# Altium project RFMC.PrjPcb (part 2 of 2)

## Sheet RFMC_DAC.SchDoc: RFMC
size 420 x 297 mm; Author: T. Przywozki; CompanyName: WUT ISE; DrawnBy: T. Przywozki; Organization: WUT ISE; Address1: Warsaw University of Technology; Address2: Nowowiejska 15/19 00-665 Warsaw; Address3: Tomasz.Przywozki@pw.edu.pl; Revision: 1.0; SheetNumber: 3; SheetTotal: 4; ModifiedBy: -; CheckedDate: -; DivGrp: ISE; Designer: T. Przywozki; Project: RFMC
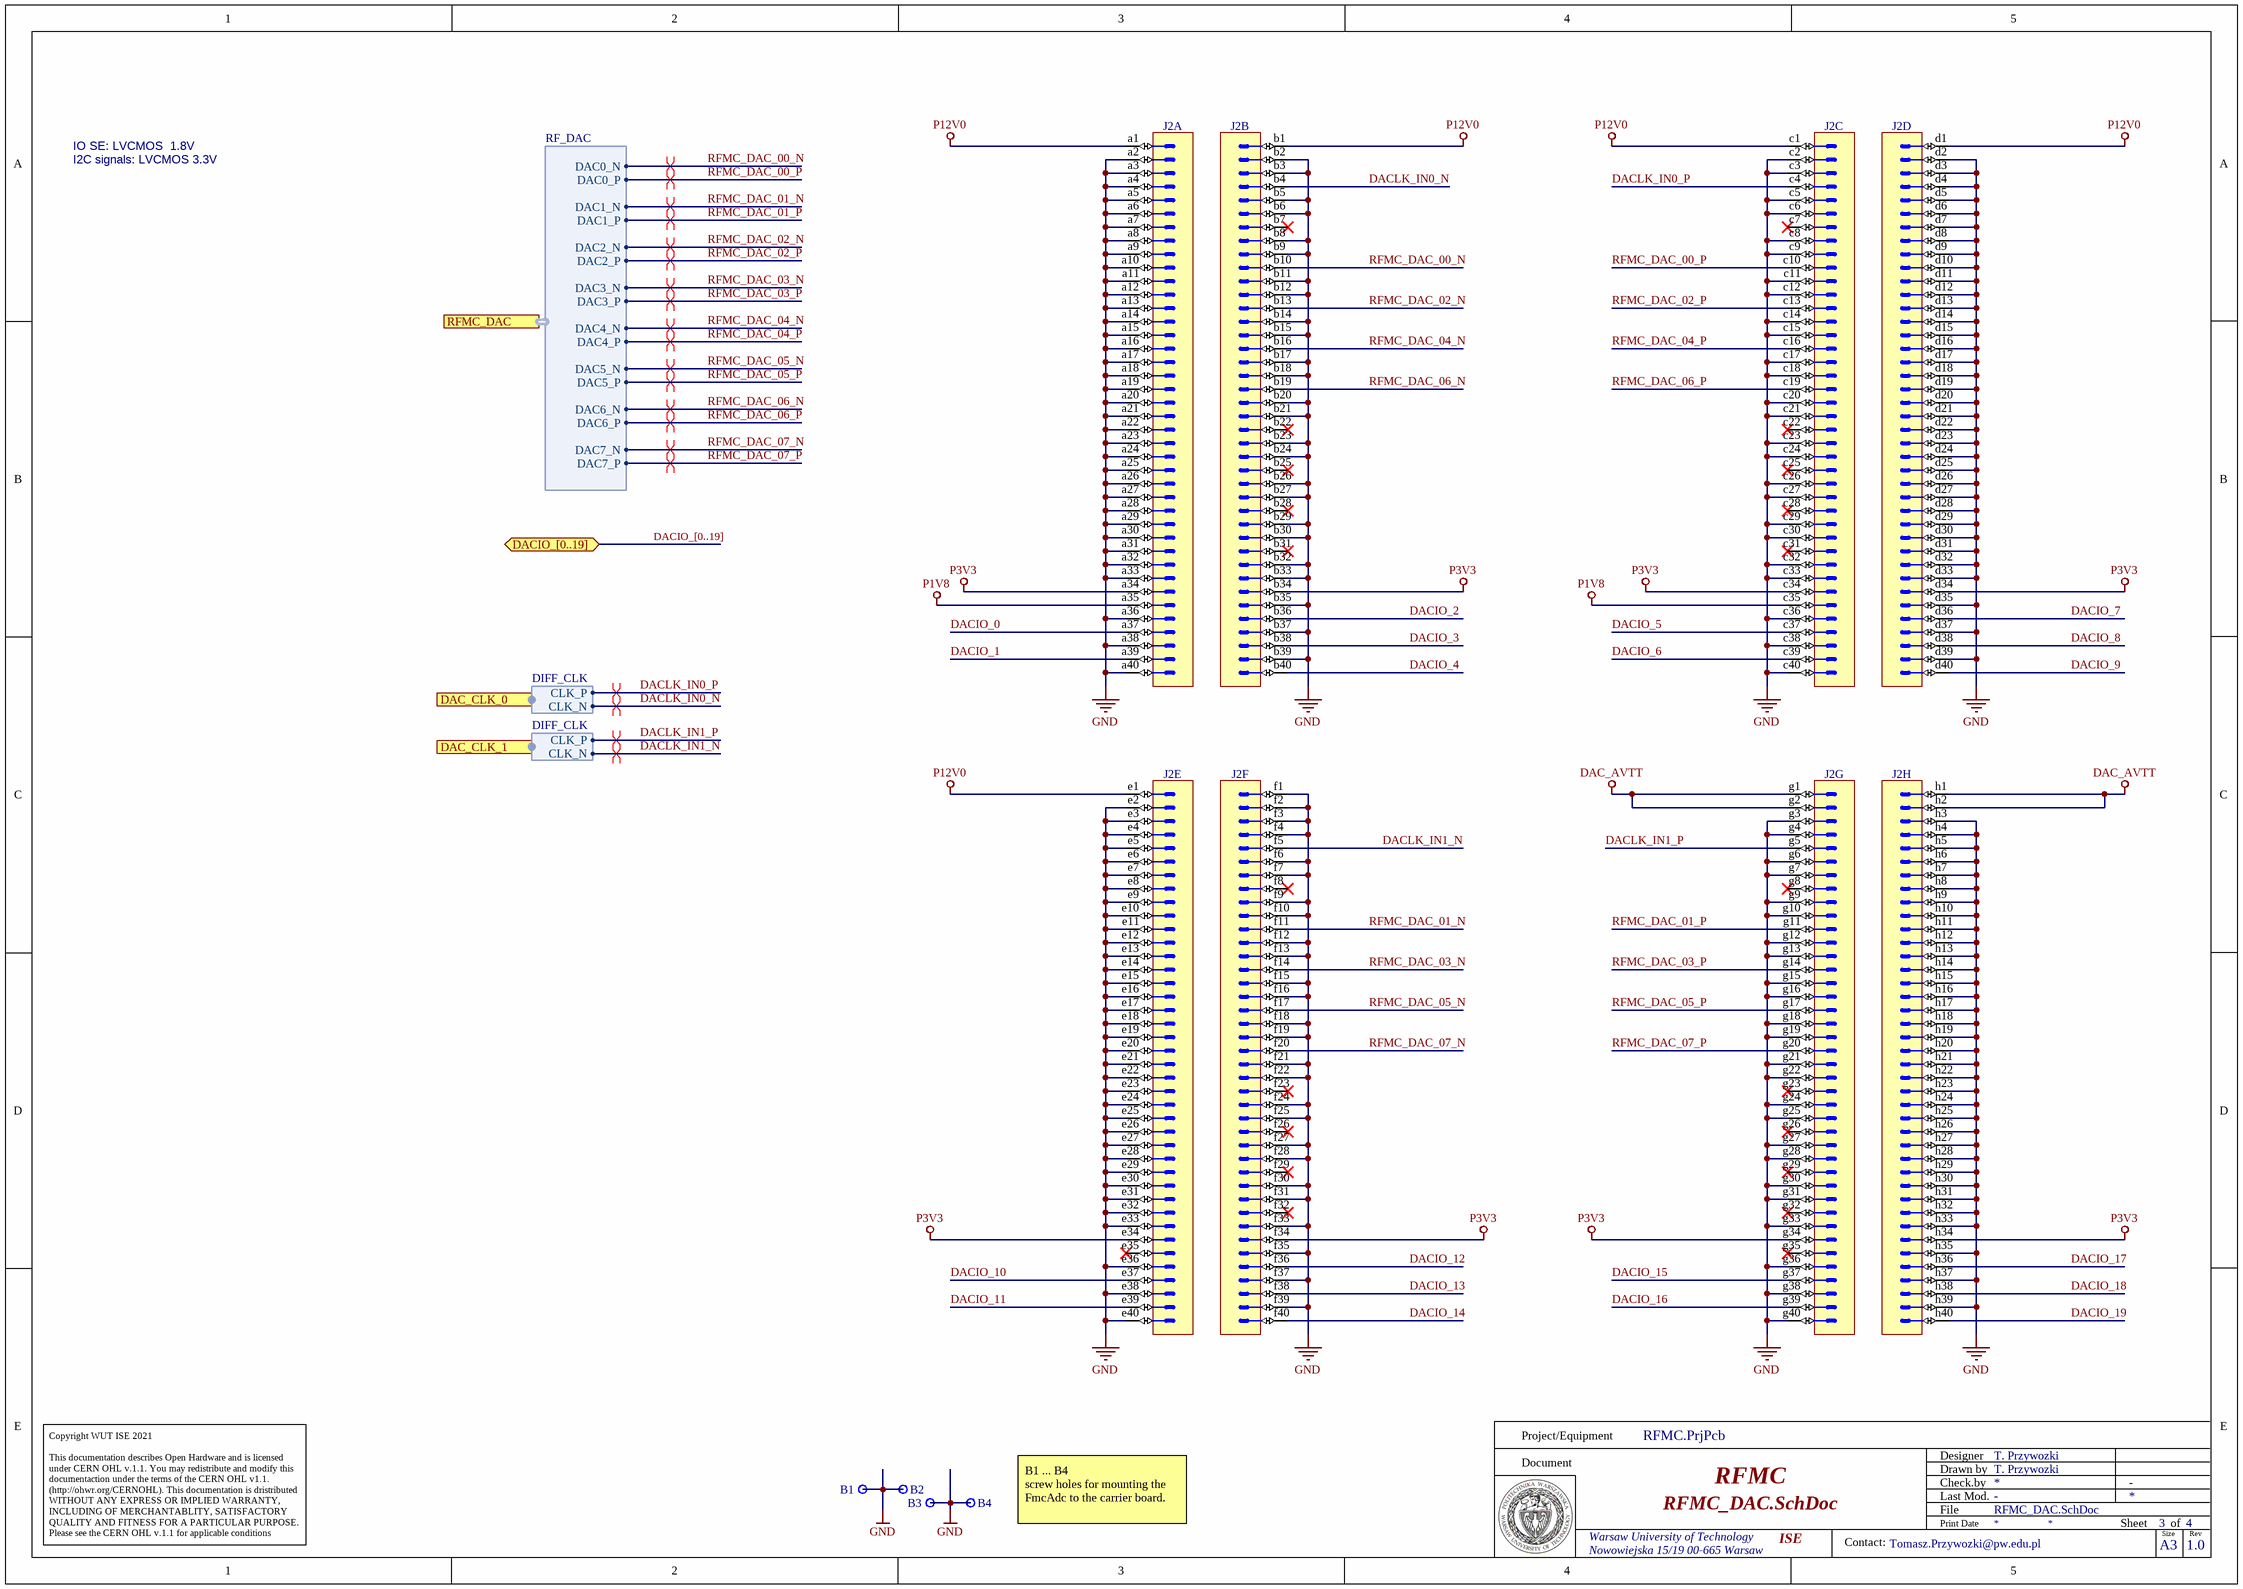
[diagram p2: RFMC_DAC.SchDoc]

### Parts
B1  Plated Hole  [MTG270_500]  (value not drawn)
B2  Plated Hole  [MTG270_500]  (value not drawn)
B3  Plated Hole  [MTG270_500]  (value not drawn)
B4  Plated Hole  [MTG270_500]  (value not drawn)
J2  (no value)  [SAMTEC_LPAM-40-01.0-S-08]  (parts A,B,C,D,E,F,G,H of 8)

### Ports
DAC_CLK_0 (harness DIFF_CLK), DAC_CLK_1 (harness DIFF_CLK), DACIO_[0..19] (bidir), RFMC_DAC (harness RF_DAC)

### Harnesses
RF_DAC: DAC0_N, DAC0_P, DAC1_N, DAC1_P, DAC2_N, DAC2_P, DAC3_N, DAC3_P, DAC4_N, DAC4_P, DAC5_N, DAC5_P, DAC6_N, DAC6_P, DAC7_N, DAC7_P
DIFF_CLK: CLK_P, CLK_N

### Nets
DAC_AVTT: J2.g1 J2.g2 J2.h1 J2.h2
GND: B1.1 B2.1 B3.1 B4.1 J2.a2 J2.a3 J2.a4 J2.a5 J2.a6 J2.a7 J2.a8 J2.a9 J2.a10 J2.a11 J2.a12 J2.a13 J2.a14 J2.a15 J2.a16 J2.a17 J2.a18 J2.a19 J2.a20 J2.a21 J2.a22 J2.a23 J2.a24 J2.a25 J2.a26 J2.a27 J2.a28 J2.a29 J2.a30 J2.a31 J2.a32 J2.a33 J2.a36 J2.a38 J2.a40 J2.b2 J2.b3 J2.b5 J2.b6 J2.b8 J2.b9 J2.b11 J2.b12 J2.b14 J2.b15 J2.b17 J2.b18 J2.b20 J2.b21 J2.b23 J2.b24 J2.b26 J2.b27 J2.b29 J2.b30 J2.b32 J2.b33 J2.b35 J2.b37 J2.b39 J2.c2 J2.c3 J2.c5 J2.c6 J2.c8 J2.c9 J2.c11 J2.c12 J2.c14 J2.c15 J2.c17 J2.c18 J2.c20 J2.c21 J2.c23 J2.c24 J2.c26 J2.c27 J2.c29 J2.c30 J2.c32 J2.c33 J2.c36 J2.c38 J2.c40 J2.d2 J2.d3 J2.d4 J2.d5 J2.d6 J2.d7 J2.d8 J2.d9 J2.d10 J2.d11 J2.d12 J2.d13 J2.d14 J2.d15 J2.d16 J2.d17 J2.d18 J2.d19 J2.d20 J2.d21 J2.d22 J2.d23 J2.d24 J2.d25 J2.d26 J2.d27 J2.d28 J2.d29 J2.d30 J2.d31 J2.d32 J2.d33 J2.d35 J2.d37 J2.d39 J2.e2 J2.e3 J2.e4 J2.e5 J2.e6 J2.e7 J2.e8 J2.e9 J2.e10 J2.e11 J2.e12 J2.e13 J2.e14 J2.e15 J2.e16 J2.e17 J2.e18 J2.e19 J2.e20 J2.e21 J2.e22 J2.e23 J2.e24 J2.e25 J2.e26 J2.e27 J2.e28 J2.e29 J2.e30 J2.e31 J2.e32 J2.e33 J2.e36 J2.e38 J2.e40 J2.f1 J2.f2 J2.f3 J2.f4 J2.f6 J2.f7 J2.f9 J2.f10 J2.f12 J2.f13 J2.f15 J2.f16 J2.f18 J2.f19 J2.f21 J2.f22 J2.f24 J2.f25 J2.f27 J2.f28 J2.f30 J2.f31 J2.f33 J2.f35 J2.f37 J2.f39 J2.g3 J2.g4 J2.g6 J2.g7 J2.g9 J2.g10 J2.g12 J2.g13 J2.g15 J2.g16 J2.g18 J2.g19 J2.g21 J2.g22 J2.g24 J2.g25 J2.g27 J2.g28 J2.g30 J2.g31 J2.g33 J2.g36 J2.g38 J2.g40 J2.h3 J2.h4 J2.h5 J2.h6 J2.h7 J2.h8 J2.h9 J2.h10 J2.h11 J2.h12 J2.h13 J2.h14 J2.h15 J2.h16 J2.h17 J2.h18 J2.h19 J2.h20 J2.h21 J2.h22 J2.h23 J2.h24 J2.h25 J2.h26 J2.h27 J2.h28 J2.h29 J2.h30 J2.h31 J2.h32 J2.h33 J2.h35 J2.h37 J2.h39
P1V8: J2.a35 J2.c35
P3V3: J2.a34 J2.b34 J2.c34 J2.d34 J2.e34 J2.f34 J2.g34 J2.h34
P12V0: J2.a1 J2.b1 J2.c1 J2.d1 J2.e1
DACIO_0: J2.a37
DACIO_1: J2.a39
DACIO_2: J2.b36
DACIO_3: J2.b38
DACIO_4: J2.b40
DACIO_5: J2.c37
DACIO_6: J2.c39
DACIO_7: J2.d36
DACIO_8: J2.d38
DACIO_9: J2.d40
DACIO_10: J2.e37
DACIO_11: J2.e39
DACIO_12: J2.f36
DACIO_13: J2.f38
DACIO_14: J2.f40
DACIO_15: J2.g37
DACIO_16: J2.g39
DACIO_17: J2.h36
DACIO_18: J2.h38
DACIO_19: J2.h40
DACLK_IN0_N: J2.b4 ; port DAC_CLK_0.CLK_N
DACLK_IN0_P: J2.c4 ; port DAC_CLK_0.CLK_P
DACLK_IN1_N: J2.f5 ; port DAC_CLK_1.CLK_N
DACLK_IN1_P: J2.g5 ; port DAC_CLK_1.CLK_P
RFMC_DAC_00_N: J2.b10 ; port RFMC_DAC.DAC0_N  [project net RFMC_DAC.DAC0_N]
RFMC_DAC_00_P: J2.c10 ; port RFMC_DAC.DAC0_P  [project net RFMC_DAC.DAC0_P]
RFMC_DAC_01_N: J2.f11 ; port RFMC_DAC.DAC1_N  [project net RFMC_DAC.DAC1_N]
RFMC_DAC_01_P: J2.g11 ; port RFMC_DAC.DAC1_P  [project net RFMC_DAC.DAC1_P]
RFMC_DAC_02_N: J2.b13 ; port RFMC_DAC.DAC2_N  [project net RFMC_DAC.DAC2_N]
RFMC_DAC_02_P: J2.c13 ; port RFMC_DAC.DAC2_P  [project net RFMC_DAC.DAC2_P]
RFMC_DAC_03_N: J2.f14 ; port RFMC_DAC.DAC3_N  [project net RFMC_DAC.DAC3_N]
RFMC_DAC_03_P: J2.g14 ; port RFMC_DAC.DAC3_P  [project net RFMC_DAC.DAC3_P]
RFMC_DAC_04_N: J2.b16 ; port RFMC_DAC.DAC4_N  [project net RFMC_DAC.DAC4_N]
RFMC_DAC_04_P: J2.c16 ; port RFMC_DAC.DAC4_P  [project net RFMC_DAC.DAC4_P]
RFMC_DAC_05_N: J2.f17 ; port RFMC_DAC.DAC5_N  [project net RFMC_DAC.DAC5_N]
RFMC_DAC_05_P: J2.g17 ; port RFMC_DAC.DAC5_P  [project net RFMC_DAC.DAC5_P]
RFMC_DAC_06_N: J2.b19 ; port RFMC_DAC.DAC6_N  [project net RFMC_DAC.DAC6_N]
RFMC_DAC_06_P: J2.c19 ; port RFMC_DAC.DAC6_P  [project net RFMC_DAC.DAC6_P]
RFMC_DAC_07_N: J2.f20 ; port RFMC_DAC.DAC7_N  [project net RFMC_DAC.DAC7_N]
RFMC_DAC_07_P: J2.g20 ; port RFMC_DAC.DAC7_P  [project net RFMC_DAC.DAC7_P]

Not connected (* = marked no-connect by the designer): J2 b7* b22* b25* b28* b31* c7* c22* c25* c28* c31* e35* f8* f23* f26* f29* f32* g8* g23* g26* g29* g32* g35*

### Buses and harness runs
bus DACIO_[0..19] = port DACIO_[0..19]

### Layout directives
differential pair: DACLK_IN0_N, DACLK_IN0_P, DACLK_IN1_N, DACLK_IN1_P
differential pair; differential pair class Analog: RFMC_DAC.DAC0_N, RFMC_DAC.DAC0_P, RFMC_DAC.DAC1_N, RFMC_DAC.DAC1_P, RFMC_DAC.DAC2_N, RFMC_DAC.DAC2_P, RFMC_DAC.DAC3_N, RFMC_DAC.DAC3_P, RFMC_DAC.DAC4_N, RFMC_DAC.DAC4_P, RFMC_DAC.DAC5_N, RFMC_DAC.DAC5_P, RFMC_DAC.DAC6_N, RFMC_DAC.DAC6_P, RFMC_DAC.DAC7_N, RFMC_DAC.DAC7_P

### Notes on the sheet
- I2C signals: LVCMOS 3.3V
- IO SE: LVCMOS  1.8V
- (near B4) B1 ... B4
  screw holes for mounting the FmcAdc to the carrier board.
- Project/Equipment
- Document
- Designer
- Drawn by
- Check.by
- Copyright WUT ISE 2021
  This documentation describes Open Hardware and is licensed under CERN OHL v.1.1. You may redistribute and modify this documentaction under the terms of the CERN OHL v1.1.
  (http://ohwr.org/CERNOHL). This documentation is dristributed WITHOUT ANY EXPRESS OR IMPLIED WARRANTY, INCLUDING OF MERCHANTABLITY, SATISFACTORY QUALITY AND FITNESS FOR A PARTICULAR PURPOSE. Please see the CERN OHL v.1.1 for applicable conditions
- File
- Last Mod.
- Print Date
- Sheet
- Size
- A3
- of
- Rev
- Contact:

### Library data of the parts
B1-B4 = PLATED_HOLE2.7_PAD5.0: Single Terminal Socket; Part Description: Plated Through Hole: Hole Dia.=2.7mm Pad Dia.=5.0mm; Mounted: No; Part Number: PLATED_HOLE2.7_PAD5.0; Component Kind: Standard (No BOM); Component Type: Standard (No BOM); Pin Count: 1; Family: Plated Hole; Socket: No; SMD: No; Sense: No; Status: None; ComponentHeight: 0mm; HelpURL: Undefined; Author: CERN DEM JMW; CreateDate: 27.09.2011; LatestRevisionDate: 27.09.2011; PackageDescription: Plated Through Hole: Hole Dia.=2.7mm Pad Dia.=5.0mm
J2 = SAMTEC_LPAM-40-01.0-S-08-2-K: Connector 320 Male contacts in 8 row abcdef; Part Description: 320 Contacts (8x40), Pitch 1.27mm, Straight High Speed Low-Profile Open-Pin-Field Header; Manufacturer: SAMTEC; PressFit: No; Sense Comment: Solder Paste Deposition Sensitive – Check Manufacturer Recommendations for Stencil Design; Part Number: SAMTEC_LPAM-40-01.0-S-08-2-K; Component Kind: Standard; Component Type: Standard; Pin Count: 320; Mounted: Yes; Socket: No; SMD: Yes; Sense: Yes; Status: None; Manufacturer Part Number: LPAM-40-01.0-S-08-2-K; ComponentHeight: 3.68mm; HelpURL: \\cern.ch\dfs\Applications\Altium\Datasheets\SAMTEC_LPAM-40-01.0-S-08-2-K.pdf; Author: CERN DEM BC; CreateDate: 31.01.2020; LatestRevisionDate: 31.01.2020

## Sheet ADC_DAC_channel.SchDoc: RFMC
size 420 x 297 mm; CompanyName: WUT; DrawnBy: T. Przywozki; Organization: WUT ISE; Address1: Warsaw University of Technology; Address2: Nowowiejska 15/19 00-665 Warsaw; Address3: Tomasz.Przywozki@pw.edu.pl; Revision: 1; SheetNumber: 4; SheetTotal: 4; Project: RFMC; ModifiedBy: -; CheckedDate: -; Title2: ADC_DAC_channel; DivGrp: ISE; Designer: T. Przywozki; ModifiedDate: -; ProjectName: ADC/DAC MEZZANINE
Used 8 times, as channels CH0, CH1, CH2, CH3, CH4, CH5, CH6, CH7. Parts and nets are listed once, with the designators drawn on the sheet.
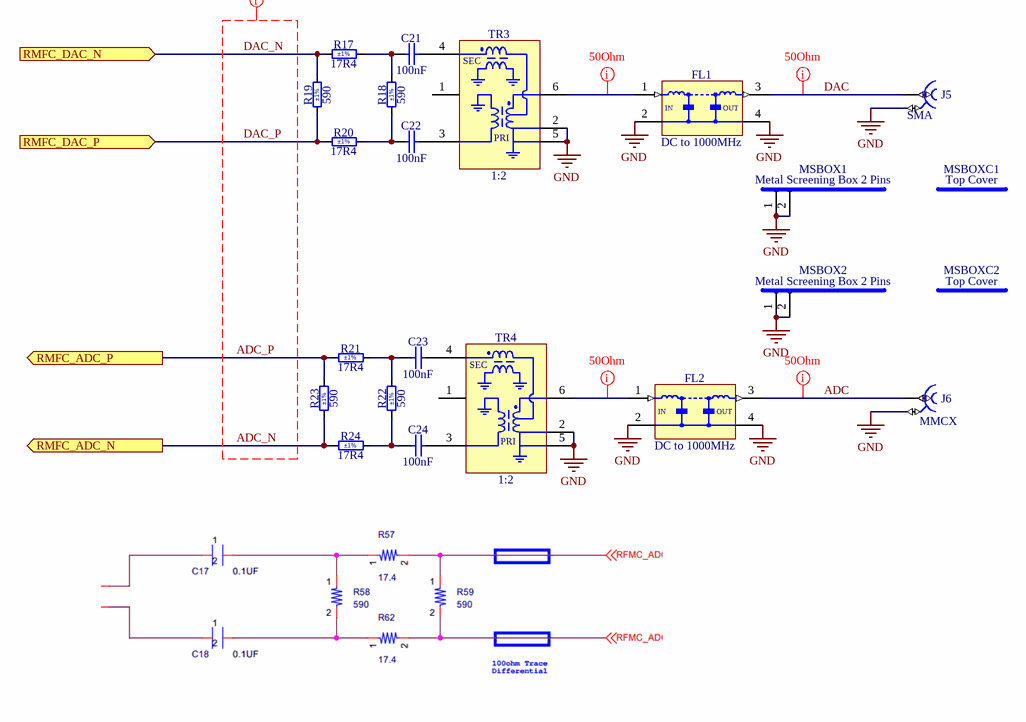
[diagram p3: ADC_DAC_channel.SchDoc]

### Parts
C21  100nF  [CAPC1005X55N]
C22  100nF  [CAPC1005X55N]
C23  100nF  [CAPC1005X55N]
C24  100nF  [CAPC1005X55N]
FL1  DC to 1000MHz  [FIL_MINI-CIRCUITS_FV1206]
FL2  DC to 1000MHz  [FIL_MINI-CIRCUITS_FV1206]
J5  SMA  [TELEGARTNER_J01151A0451]
J6  Family: MMCX  [HUBER-SUHNER_85_MMCX-50-0-1/111_OE]  (hidden comment: Coax_1Female_1Shield)
MSBOX1  Metal Screening Box 2 Pins  [MSBOX_WURTH_3670130]
MSBOX2  Metal Screening Box 2 Pins  [MSBOX_WURTH_3670130]
MSBOXC1  Top Cover  [MSBOX_WURTH_3671130]
MSBOXC2  Top Cover  [MSBOX_WURTH_3671130]
R17  17R4  Tolerance: ±1%  [RESC1005X40N]
R18  590  Tolerance: ±1%  [RESC1005X40N]
R19  590  Tolerance: ±1%  [RESC1005X40N]
R20  17R4  Tolerance: ±1%  [RESC1005X40N]
R21  17R4  Tolerance: ±1%  [RESC1005X40N]
R22  590  Tolerance: ±1%  [RESC1005X40N]
R23  590  Tolerance: ±1%  [RESC1005X40N]
R24  17R4  Tolerance: ±1%  [RESC1005X40N]
TR3  1:2  [XFMR_MINI-CIRCUITS_DB1627]
TR4  1:2  [XFMR_MINI-CIRCUITS_DB1627]

### Ports
RMFC_ADC_N (out), RMFC_ADC_P (out), RMFC_DAC_N (in), RMFC_DAC_P (in)

### Nets
GND: FL1.2(GND) FL1.4(GND) FL2.2(GND) FL2.4(GND) J5.2 J6.2 MSBOX1.1 MSBOX1.2 MSBOX2.1 MSBOX2.2 TR3.2(P) TR3.5(GND) TR4.2(P) TR4.5(GND)
ADC: FL2.3(RFOUT) J6.1
ADC_N: R23.1 R24.1 ; port RMFC_ADC_N
ADC_P: R21.1 R23.2 ; port RMFC_ADC_P
DAC: FL1.3(RFOUT) J5.1
DAC_N: R17.1 R19.2 ; port RMFC_DAC_N
DAC_P: R19.1 R20.1 ; port RMFC_DAC_P
NetC21_1: C21.1 R17.2 R18.2
NetC21_2: C21.2 TR3.4(SD)
NetC22_1: C22.1 R18.1 R20.2
NetC22_2: C22.2 TR3.3(S)
NetC23_1: C23.1 R21.2 R22.2
NetC23_2: C23.2 TR4.4(SD)
NetC24_1: C24.1 R22.1 R24.2
NetC24_2: C24.2 TR4.3(S)
NetFL1_1: FL1.1(RFIN) TR3.6(P1)
NetFL2_1: FL2.1(RFIN) TR4.6(P1)

Not connected (* = marked no-connect by the designer): TR3 1(NC); TR4 1(NC)

### Channels
CH0: designators end in _CH0; ports RMFC_ADC_N=ADC_N_CH0 RMFC_ADC_P=ADC_P_CH0 RMFC_DAC_N=DAC_N_CH0 RMFC_DAC_P=DAC_P_CH0
CH1: designators end in _CH1; ports RMFC_ADC_N=ADC_N_CH1 RMFC_ADC_P=ADC_P_CH1 RMFC_DAC_N=DAC_N_CH1 RMFC_DAC_P=DAC_P_CH1
CH2: designators end in _CH2; ports RMFC_ADC_N=ADC_N_CH2 RMFC_ADC_P=ADC_P_CH2 RMFC_DAC_N=DAC_N_CH2 RMFC_DAC_P=DAC_P_CH2
CH3: designators end in _CH3; ports RMFC_ADC_N=ADC_N_CH3 RMFC_ADC_P=ADC_P_CH3 RMFC_DAC_N=DAC_N_CH3 RMFC_DAC_P=DAC_P_CH3
CH4: designators end in _CH4; ports RMFC_ADC_N=ADC_N_CH4 RMFC_ADC_P=ADC_P_CH4 RMFC_DAC_N=DAC_N_CH4 RMFC_DAC_P=DAC_P_CH4
CH5: designators end in _CH5; ports RMFC_ADC_N=ADC_N_CH5 RMFC_ADC_P=ADC_P_CH5 RMFC_DAC_N=DAC_N_CH5 RMFC_DAC_P=DAC_P_CH5
CH6: designators end in _CH6; ports RMFC_ADC_N=ADC_N_CH6 RMFC_ADC_P=ADC_P_CH6 RMFC_DAC_N=DAC_N_CH6 RMFC_DAC_P=DAC_P_CH6
CH7: designators end in _CH7; ports RMFC_ADC_N=ADC_N_CH7 RMFC_ADC_P=ADC_P_CH7 RMFC_DAC_N=DAC_N_CH7 RMFC_DAC_P=DAC_P_CH7

### Layout directives
net class SE50; net class ANALOG: ADC_CH0, DAC_CH0, NetFL1_CH0_1, NetFL2_CH0_1
net class ANALOG: ADC_N, ADC_P, DAC_N, DAC_P

### Notes on the sheet
- Project/Equipment
- Document
- Designer
- Drawn by
- Check.by
- Copyright WUT ISE 2021
  This documentation describes Open Hardware and is licensed under CERN OHL v.1.1. You may redistribute and modify this documentaction under the terms of the CERN OHL v1.1.
  (http://ohwr.org/CERNOHL). This documentation is dristributed WITHOUT ANY EXPRESS OR IMPLIED WARRANTY, INCLUDING OF MERCHANTABLITY, SATISFACTORY QUALITY AND FITNESS FOR A PARTICULAR PURPOSE. Please see the CERN OHL v.1.1 for applicable conditions
- File
- Last Mod.
- Print Date
- Sheet
- Size
- A3
- of
- Rev
- Contact:
- (in symbol FIL_MINI-CIRCUITS_LFCN-1000+) IN; OUT
- (in symbol XFMR_MINI-CIRCUITS_TCM2-33WX+) SEC; PRI

### Library data of the parts
C21-C24 = CC0402_100NF_16V_10%_X5R: Non-polarised capacitor; Part Description: SMD Multilayer Chip Ceramic Capacitor; Manufacturer: GENERIC; Manufacturer1 Part Number: GRM155R61C104KA88D; Voltage: 16V; TC: X5R; Tolerance: ±10%; Part Number: CC0402_100NF_16V_10%_X5R; Component Kind: Standard; Component Type: Standard; Pin Count: 2; Value: 100nF; Status: None; Manufacturer Part Number: CC0402_100NF_16V_10%_X5R; Case: 0402; Mounted: Yes; Socket: No; SMD: Yes; Sense: No; Manufacturer1 Example: MURATA; Manufacturer1 ComponentHeight: 0.55mm; HelpURL: \\cern.ch\dfs\Applications\Altium\Datasheets\CC0402_X5R_MURATA_GRM.pdf; Author: CERN DEM JLC; CreateDate: 10.12.2013; LatestRevisionDate: 10.12.2013
FL1 FL2 = FIL_MINI-CIRCUITS_LFCN-1000+: 50 Ohm Low Pass Filter; Part Number: FIL_MINI-CIRCUITS_LFCN-1000+; Component Kind: Standard; Component Type: Standard; Pin Count: 4; Value: DC to 1000MHz; Status: None; Part Description: 50 Ohm Low Pass Filter; Manufacturer: MINI-CIRCUITS; Manufacturer Part Number: LFCN-1000+; Mounted: Yes; Socket: No; SMD: Yes; Sense: No; ComponentHeight: 0.94mm; HelpURL: \\cern.ch\dfs\Applications\Altium\Datasheets\FIL_MINI-CIRCUITS_LFCN-1000+.pdf; Author: CERN DEM MR; CreateDate: 05.04.2019; LatestRevisionDate: 05.04.2019
J5 = TELEGARTNER_J01151A0451: Part Description: SMA 50 ohms Edge Mount Bulkhead Jack Receptacle; PressFit: No; Part Number: TELEGARTNER_J01151A0451; Component Kind: Standard; Component Type: Standard; Pin Count: 2; Family: SMA; Mounted: Yes; Socket: No; SMD: No; Sense: No; Status: None; Manufacturer: TELEGARTNER; Manufacturer Part Number: J01151A0451; ComponentHeight: 7mm; HelpURL: \\cern.ch\dfs\Applications\Altium\Datasheets\TELEGARTNER_J01151A0451.pdf; Author: CERN DEM JLC; CreateDate: 27.10.2016; LatestRevisionDate: 27.10.2016
J6 = HUBER-SUHNER_85_MMCX-50-0-1/111_OE: Part Description: MMCX 50 Ohms Right Angle PCB Jack; Manufacturer: HUBER+SUHNER; PressFit: No; Part Number: HUBER-SUHNER_85_MMCX-50-0-1/111_OE; Component Kind: Standard; Component Type: Standard; Pin Count: 2; Mounted: Yes; Socket: No; SMD: No; Sense: No; Status: None; Manufacturer Part Number: 85_MMCX-50-0-1/111_OE; ComponentHeight: 9.6mm; HelpURL: \\cern.ch\dfs\Applications\Altium\Datasheets\HUBER-SUHNER_85_MMCX-50-0-1-111_OE.pdf; Author: CERN DEM JLC; CreateDate: 06.11.2014; LatestRevisionDate: 06.11.2014
MSBOX1 MSBOX2 = MSBOX_WURTH_3670130: Part Description: Seamless Shielding Cabinet SMD-Frame WE-SHC (Two-Piece), Internal Dimensions 12.4 x 12.4mm; Manufacturer: WURTH; PressFit: No; Part Number: MSBOX_WURTH_3670130; Component Kind: Standard; Component Type: Standard; Pin Count: 2; PackageDescription: Seamless Shielding Cabinet SMD-Frame WE-SHC (Two-Piece), Internal Dimensions 12.4 x 12.4mm; Mounted: Yes; Socket: No; SMD: Yes; Sense: No; Status: None; Manufacturer Part Number: 3670130; ComponentHeight: 5.2mm; HelpURL: \\cern.ch\dfs\Applications\Altium\Datasheets\MSBOX_WURTH_3670130.pdf; Author: CERN DEM BC; CreateDate: 19.04.2021; LatestRevisionDate: 19.04.2021
MSBOXC1 MSBOXC2 = MSBOX_WURTH_3671130: Metal Screening Box - Top Cover 0 Pin; Part Description: Top Cover For Frame WE-SHC (Two-Piece) Seamless Shielding Cabinet, Internal Dimensions 12.4 x 12.4mm; Manufacturer: WURTH; PressFit: No; Part Number: MSBOX_WURTH_3671130; Component Kind: Accessories; Component Type: Standard; Pin Count: 0; PackageDescription: Top Cover For Frame WE-SHC (Two-Piece) Seamless Shielding Cabinet, Internal Dimensions 12.4 x 12.4mm; Mounted: Yes; Socket: No; SMD: No; Sense: No; Status: None; Manufacturer Part Number: 3671130; ComponentHeight: 3mm; HelpURL: \\cern.ch\dfs\Applications\Altium\Datasheets\MSBOX_WURTH_3671130.pdf; Author: CERN DEM BC; CreateDate: 19.04.2021; LatestRevisionDate: 19.04.2021
R17 R20 R21 R24 = R0402_17R4_1%_0.1W_100PPM: Resistor - 1%; Part Description: General Purpose Thick Film Chip Resistor; Manufacturer: GENERIC; Manufacturer1 Part Number: ERJ2RKF17R4X; Power: 0.1W; TC: ±100ppm/°C; Voltage: 50V; PressFit: No; Part Number: R0402_17R4_1%_0.1W_100PPM; Component Kind: Standard; Component Type: Standard; Pin Count: 2; Value: 17R4; Status: Not Recommended; Manufacturer Part Number: R0402_17R4_1%_0.1W_100PPM; Case: 0402; Mounted: Yes; Sense: No; Socket: No; SMD: Yes; Manufacturer1 Example: PANASONIC; Manufacturer1 ComponentHeight: 0.4mm; HelpURL: \\cern.ch\dfs\Applications\Altium\Datasheets\R0402_PANASONIC_ERJ2RK.pdf; Author: CERN DEM BC; CreateDate: 19.04.2021; LatestRevisionDate: 19.04.2021
R18 R19 R22 R23 = R0402_590R_1%_0.1W_100PPM: Resistor - 1%; Part Description: General Purpose Thick Film Chip Resistor; Manufacturer: GENERIC; Manufacturer1 Part Number: ERJ2RKF5900X; Power: 0.1W; TC: ±100ppm/°C; Voltage: 50V; PressFit: No; Part Number: R0402_590R_1%_0.1W_100PPM; Component Kind: Standard; Component Type: Standard; Pin Count: 2; Value: 590; Status: Not Recommended; Manufacturer Part Number: R0402_590R_1%_0.1W_100PPM; Case: 0402; Mounted: Yes; Sense: No; Socket: No; SMD: Yes; Manufacturer1 Example: PANASONIC; Manufacturer1 ComponentHeight: 0.4mm; HelpURL: \\cern.ch\dfs\Applications\Altium\Datasheets\R0402_PANASONIC_ERJ2RK.pdf; Author: CERN DEM BC; CreateDate: 19.04.2021; LatestRevisionDate: 19.04.2021
TR3 TR4 = XFMR_MINI-CIRCUITS_TCM2-33WX+: 50 OHMS 10 to 3000 MHz RF Transformer; Power: 0.4W; Part Number: XFMR_MINI-CIRCUITS_TCM2-33WX+; Component Kind: Standard; Component Type: Standard; Pin Count: 6; Value: 1:2; Status: None; Part Description: 50 Ohms 10 to 3000MHz RF Transformer; Manufacturer: MINI-CIRCUITS; Manufacturer Part Number: TCM2-33WX+; Mounted: Yes; Socket: No; Sense: No; SMD: Yes; ComponentHeight: 4.06mm; HelpURL: \\cern.ch\dfs\Applications\Altium\Datasheets\XFMR_MINI-CIRCUITS_TCM2-33WX+.pdf; Author: CERN DEM MR; CreateDate: 01.12.2016; LatestRevisionDate: 01.12.2016

## Nets that join several sheets
DAC_AVTT: RFMC (R39.1 R41.1), RFMC_DAC (J2.g1 J2.g2 J2.h1 J2.h2)
GND: RFMC (69 pins), RFMC_ADC (259 pins), RFMC_DAC (243 pins), CH0 (14 pins), CH1 (14 pins), CH2 (14 pins), CH3 (14 pins), CH4 (14 pins), CH5 (14 pins), CH6 (14 pins), CH7 (14 pins)
P1V8: RFMC (11 pins), RFMC_ADC (J1.a6 J1.c6), RFMC_DAC (J2.a35 J2.c35)
P3V3: RFMC (23 pins), RFMC_ADC (8 pins), RFMC_DAC (8 pins)
P12V0: RFMC (R30.1 R33.1), RFMC_DAC (5 pins)
ADCIO_0: RFMC (IC1.10), RFMC_ADC (J1.a2)
ADCIO_1: RFMC (IC1.15), RFMC_ADC (J1.a4)
ADCIO_2: RFMC (IC1.20), RFMC_ADC (J1.b1)
ADCIO_3: RFMC (IC1.18), RFMC_ADC (J1.b3)
ADCIO_4: RFMC (IC1.13), RFMC_ADC (J1.b5)
ADCIO_5: RFMC (IC1.9), RFMC_ADC (J1.c2)
ADCIO_6: RFMC (IC1.11), RFMC_ADC (J1.c4)
ADCIO_7: RFMC (IC1.6), RFMC_ADC (J1.d1)
ADCIO_8: RFMC (IC1.17), RFMC_ADC (J1.d3)
ADCIO_9: RFMC (IC1.16), RFMC_ADC (J1.d5)
ADCIO_10: RFMC (IC1.7), RFMC_ADC (J1.e2)
ADCIO_11: RFMC (IC1.19), RFMC_ADC (J1.e4)
ADCIO_12: RFMC (IC1.4), RFMC_ADC (J1.f1)
ADCIO_13: RFMC (IC1.8), RFMC_ADC (J1.f3)
ADCIO_14: RFMC (IC1.14), RFMC_ADC (J1.f5)
ADCIO_15: RFMC (IC1.5), RFMC_ADC (J1.g2)
ADCIO_16: RFMC (IC1.1 R2.2), RFMC_ADC (J1.g4)
ADCIO_17: RFMC (IC1.3 R1.2), RFMC_ADC (J1.h1)
ADCIO_18: RFMC (T1.1), RFMC_ADC (J1.h3)
ADCIO_19: RFMC (T2.1), RFMC_ADC (J1.h5)
ADCLK0_N: RFMC (OSC1.5 R6.2), RFMC_ADC (J1.b36)
ADCLK0_P: RFMC (OSC1.4 R5.2), RFMC_ADC (J1.c36)
ADCLK1_N: RFMC (OSC2.5), RFMC_ADC (J1.f35)
ADCLK1_P: RFMC (OSC2.4), RFMC_ADC (J1.g35)
ADCLK2_N: RFMC (OSC3.5), RFMC_ADC (J1.b39)
ADCLK2_P: RFMC (OSC3.4), RFMC_ADC (J1.c39)
ADCLK3_N: RFMC (TR1.4), RFMC_ADC (J1.f38)
ADCLK3_P: RFMC (TR1.3), RFMC_ADC (J1.g38)
DACIO_0: RFMC (IC2.8), RFMC_DAC (J2.a37)
DACIO_1: RFMC (IC2.6), RFMC_DAC (J2.a39)
DACIO_2: RFMC (IC2.11), RFMC_DAC (J2.b36)
DACIO_3: RFMC (IC2.13), RFMC_DAC (J2.b38)
DACIO_4: RFMC (IC2.4), RFMC_DAC (J2.b40)
DACIO_5: RFMC (IC2.7), RFMC_DAC (J2.c37)
DACIO_6: RFMC (IC2.5), RFMC_DAC (J2.c39)
DACIO_7: RFMC (IC2.10), RFMC_DAC (J2.d36)
DACIO_8: RFMC (IC2.15), RFMC_DAC (J2.d38)
DACIO_9: RFMC (IC2.19), RFMC_DAC (J2.d40)
DACIO_10: RFMC (IC2.14), RFMC_DAC (J2.e37)
DACIO_11: RFMC (IC2.18), RFMC_DAC (J2.e39)
DACIO_12: RFMC (IC2.9), RFMC_DAC (J2.f36)
DACIO_13: RFMC (IC2.17), RFMC_DAC (J2.f38)
DACIO_14: RFMC (IC2.20), RFMC_DAC (J2.f40)
DACIO_15: RFMC (IC2.16), RFMC_DAC (J2.g37)
DACIO_16: RFMC (IC2.1 R11.2), RFMC_DAC (J2.g39)
DACIO_17: RFMC (IC2.3 R10.2), RFMC_DAC (J2.h36)
DACIO_18: RFMC (T4.1), RFMC_DAC (J2.h38)
DACIO_19: RFMC (T3.1), RFMC_DAC (J2.h40)
DACLK_IN0_N: RFMC (OSC4.5 R15.2), RFMC_DAC (J2.b4)
DACLK_IN0_P: RFMC (OSC4.4 R14.2), RFMC_DAC (J2.c4)
DACLK_IN1_N: RFMC (TR2.4), RFMC_DAC (J2.f5)
DACLK_IN1_P: RFMC (TR2.3), RFMC_DAC (J2.g5)
RFMC_I2C_SCL: RFMC (IC1.22 IC2.22 IC3.1 IC4.19), RFMC_ADC (J1.g6)
RFMC_I2C_SDA: RFMC (IC1.23 IC2.23 IC3.2 IC4.20), RFMC_ADC (J1.e6)

## Assembly variants
Default: not fitted R7 R16